# Altium schematic sheet STM32-ROMI_Rev_A_5_IMU_IO.SchDoc: IMU I/O
size A4; Author: Kyle R; Organization: Altium Limited; Address1: L3, 12a Rodborough Rd; Address2: Frenchs Forest; Address3: NSW; Address4: Australia 2086; DocumentNumber: 9152020; Revision: A; SheetNumber: 5; SheetTotal: 7
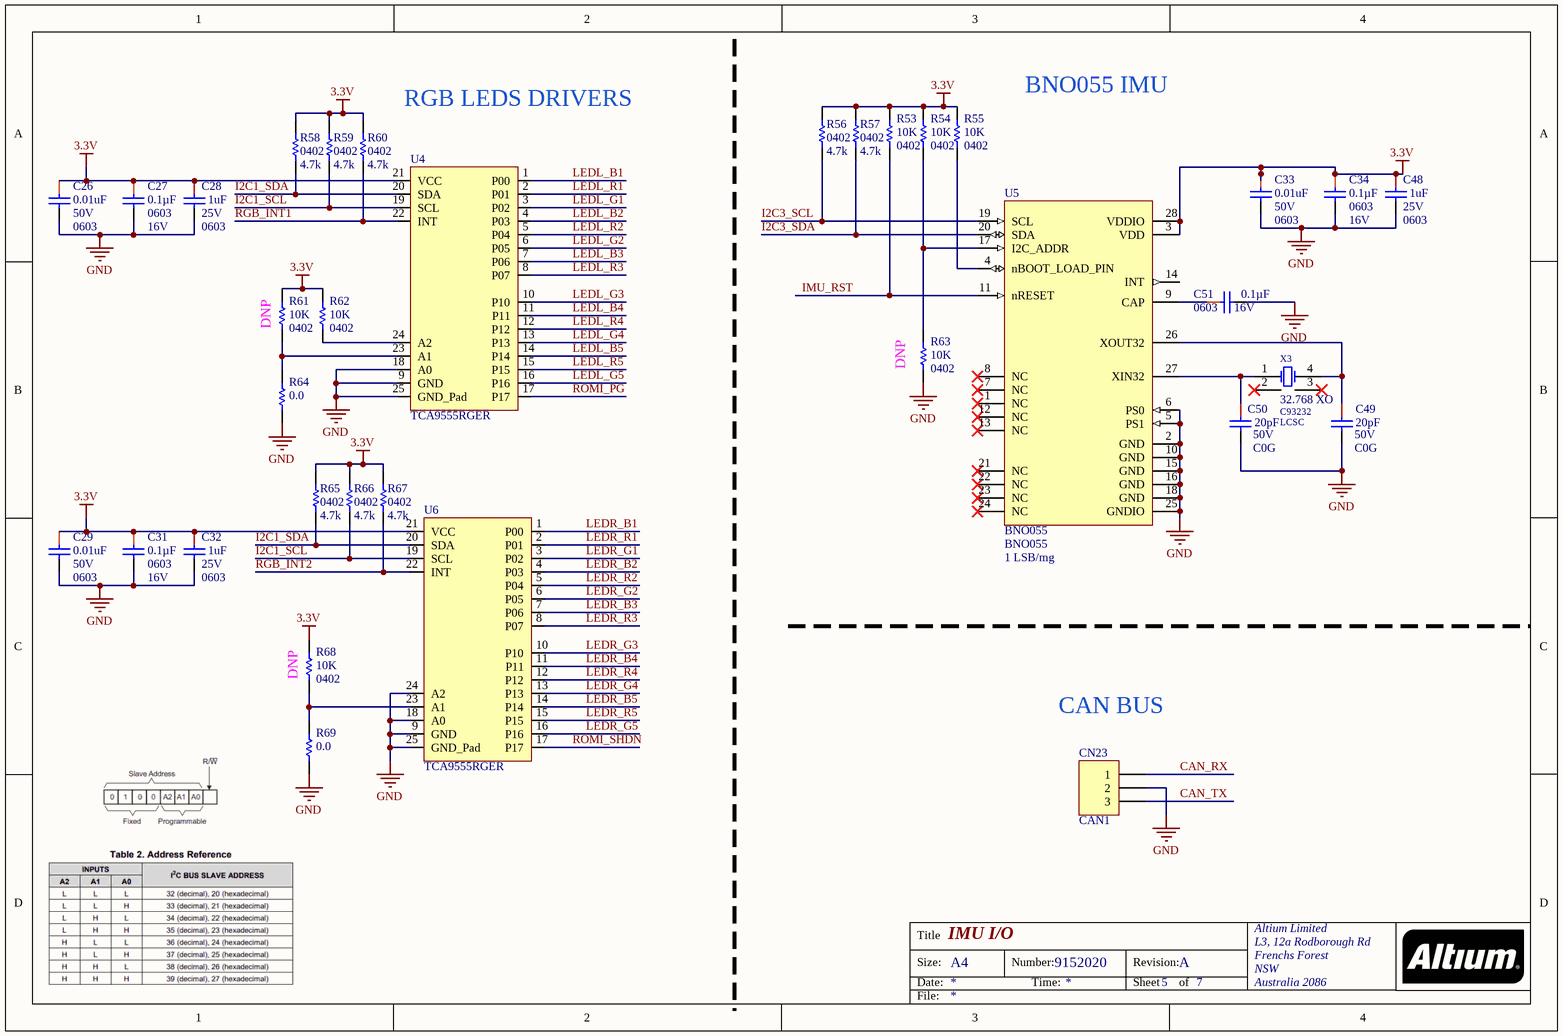
[diagram p0: STM32-ROMI_Rev_A_5_IMU_IO.SchDoc]

## Parts
C26  0.01uF  Voltage - Rated: 50V  Package / Case: 0603  [CAPC0603(1608)_L]
C27  Capacitance: 0.1µF  Package / Case: 0603  Voltage - Rated: 16V  [CAPC0603(1608)_L]  (hidden comment: 0.1uF)
C28  1uF  Voltage - Rated: 25V  Package / Case: 0603  [CAPC0603(1608)_N]
C29  0.01uF  Voltage - Rated: 50V  Package / Case: 0603  [CAPC0603(1608)_L]
C31  Capacitance: 0.1µF  Package / Case: 0603  Voltage - Rated: 16V  [CAPC0603(1608)_L]  (hidden comment: 0.1uF)
C32  1uF  Voltage - Rated: 25V  Package / Case: 0603  [CAPC0603(1608)_N]
C33  0.01uF  Voltage - Rated: 50V  Package / Case: 0603  [CAPC0603(1608)_L]
C34  Capacitance: 0.1µF  Package / Case: 0603  Voltage - Rated: 16V  [CAPC0603(1608)_L]  (hidden comment: 0.1uF)
C48  1uF  Voltage - Rated: 25V  Package / Case: 0603  [CAPC0603(1608)_N]
C49  Voltage - Rated: 50V  Temperature Coefficient: C0G  Capacitance: 20pF  [CAPC0402(1005)_L]  (hidden comment: 20pF 0402)
C50  Voltage - Rated: 50V  Temperature Coefficient: C0G  Capacitance: 20pF  [CAPC0402(1005)_L]  (hidden comment: 20pF 0402)
C51  Capacitance: 0.1µF  Package / Case: 0603  Voltage - Rated: 16V  [CAPC0603(1608)_L]  (hidden comment: 0.1uF)
CN23  CAN1  [HDR1X3]
R53  10K  Supplier Device Package: 0402  [RESC0402(1005)_N]
R54  10K  Supplier Device Package: 0402  [RESC0402(1005)_N]
R55  10K  Supplier Device Package: 0402  [RESC0402(1005)_N]
R56  Package / Case: 0402  [RESC0402(1005)_N]  (hidden comment: 4.7K)
R57  Package / Case: 0402  [RESC0402(1005)_N]  (hidden comment: 4.7K)
R58  Package / Case: 0402  [RESC0402(1005)_N]  (hidden comment: 4.7K)
R59  Package / Case: 0402  [RESC0402(1005)_N]  (hidden comment: 4.7K)
R60  Package / Case: 0402  [RESC0402(1005)_N]  (hidden comment: 4.7K)
R61  10K  Supplier Device Package: 0402  [RESC0402(1005)_N]  (no BOM)
R62  10K  Supplier Device Package: 0402  [RESC0402(1005)_N]
R63  10K  Supplier Device Package: 0402  [RESC0402(1005)_N]  (no BOM)
R64  Resistance (Ohms): 0.0  [RESC0402(1005)_L]  (hidden comment: 0)
R65  Package / Case: 0402  [RESC0402(1005)_N]  (hidden comment: 4.7K)
R66  Package / Case: 0402  [RESC0402(1005)_N]  (hidden comment: 4.7K)
R67  Package / Case: 0402  [RESC0402(1005)_N]  (hidden comment: 4.7K)
R68  10K  Supplier Device Package: 0402  [RESC0402(1005)_N]  (no BOM)
R69  Resistance (Ohms): 0.0  [RESC0402(1005)_L]  (hidden comment: 0)
U4  TCA9555RGER  [QFN50P400X400X100_HS-25N]
U5  BNO055  Sensitivity: 1 LSB/mg  [LGA-28-3.8x5.2mm]
U6  TCA9555RGER  [QFN50P400X400X100_HS-25N]
X3  32.768 XO  Supplier Part Number 2: C93232  Supplier 2: LCSC  [OSCABS]

## Nets
3.3V: C26.1 C27.1 C28.1 C29.1 C31.1 C32.1 C33.1 C34.1 C48.1 R53.2 R54.2 R55.2 R56.2 R57.2 R58.2 R59.2 R60.2 R61.2 R62.2 R65.2 R66.2 R67.2 R68.2 U4.21(VCC) U5.3(VDD) U5.28(VDDIO) U6.21(VCC)
GND: C26.2 C27.2 C28.2 C29.2 C31.2 C32.2 C33.2 C34.2 C48.2 C49.2 C50.2 C51.2 CN23.2 R63.1 R64.1 R69.1 U4.9(GND) U4.18(A0) U4.25(GND_Pad) U5.2(GND) U5.5(PS1) U5.6(PS0) U5.10(GND) U5.15(GND) U5.16(GND) U5.18(GND) U5.25(GNDIO) U6.9(GND) U6.18(A0) U6.24(A2) U6.25(GND_Pad)
CAN_RX: CN23.1
CAN_TX: CN23.3
I2C1_SCL: R59.1 R66.1 U4.19(SCL) U6.19(SCL)
I2C1_SDA: R58.1 R65.1 U4.20(SDA) U6.20(SDA)
I2C3_SCL: R56.1 U5.19(SCL)
I2C3_SDA: R57.1 U5.20(SDA)
IMU_RST: R53.1 U5.11(nRESET)
LEDL_B1: U4.1(P00)
LEDL_B2: U4.4(P03)
LEDL_B3: U4.7(P06)
LEDL_B4: U4.11(P11)
LEDL_B5: U4.14(P14)
LEDL_G1: U4.3(P02)
LEDL_G2: U4.6(P05)
LEDL_G3: U4.10(P10)
LEDL_G4: U4.13(P13)
LEDL_G5: U4.16(P16)
LEDL_R1: U4.2(P01)
LEDL_R2: U4.5(P04)
LEDL_R3: U4.8(P07)
LEDL_R4: U4.12(P12)
LEDL_R5: U4.15(P15)
LEDR_B1: U6.1(P00)
LEDR_B2: U6.4(P03)
LEDR_B3: U6.7(P06)
LEDR_B4: U6.11(P11)
LEDR_B5: U6.14(P14)
LEDR_G1: U6.3(P02)
LEDR_G2: U6.6(P05)
LEDR_G3: U6.10(P10)
LEDR_G4: U6.13(P13)
LEDR_G5: U6.16(P16)
LEDR_R1: U6.2(P01)
LEDR_R2: U6.5(P04)
LEDR_R3: U6.8(P07)
LEDR_R4: U6.12(P12)
LEDR_R5: U6.15(P15)
RGB_INT1: R60.1 U4.22(INT)
RGB_INT2: R67.1 U6.22(INT)
ROMI_PG: U4.17(P17)
ROMI_SHDN: U6.17(P17)
NetC49_1: C49.1 U5.26(XOUT32) X3.4(OSC2)
NetC50_1: C50.1 U5.27(XIN32) X3.1(OSC1)
NetC51_1: C51.1 U5.9(CAP)
NetR54_1: R54.1 R63.2 U5.17(I2C_ADDR)
NetR55_1: R55.1 U5.4(nBOOT_LOAD_PIN)
NetR61_1: R61.1 R64.2 U4.23(A1)
NetR62_1: R62.1 U4.24(A2)
NetR68_1: R68.1 R69.2 U6.23(A1)

Not connected (* = marked no-connect by the designer): U5 1(NC)* 7(NC)* 8(NC)* 12(NC)* 13(NC)* 14(INT) 21(NC)* 22(NC)* 23(NC)* 24(NC)*; X3 2(NC)* 3(NC)*

## Notes on the sheet
- RGB LEDS DRIVERS
- BNO055 IMU
- (near R61) DNP
- (near R63) DNP
- (near R68) DNP
- CAN BUS
- Title
- Size:
- Date:
- A4
- Number:
- Time:
- Revision:
- Sheet
- of
- File:

## Library data of the parts
C26 C29 C33 = CAP CER 0.01uF 50V 10% X7R 0603: 0.01uF 50V 0603; Manufacturer: Kemet; Manufacturer Part Number: C0603C103K5RACTU; Capacitance: 10000pF; Tolerance: ±10%; Temperature Coefficient: X7R; ClassName: MCU; Supplier 1: Digi-Key; RoHS: RoHS Compliant; Category: Capacitors; Stock 1: 1304139; Pricing 1: 1=0.1, 10=0.02, 25=0.014, 50=0.0106, 100=0.009, 250=0.00736, 1000=0.0048 (USD); Packaging: Cut Tape (CT); Mounting Type: Surface Mount, MLCC; Operating Temperature: -55°C ~ 125°C; Applications: General Purpose; Ratings: -; Size / Dimension: 0.063" L x 0.031" W (1.60mm x 0.80mm); Height - Seated (Max): -; Thickness (Max): 0.034" (0.87mm); Lead Spacing: -; Features: -; Lead Style: -; ComponentLink1URL: http://www.kemet.com/docfinder?Partnumber=C0603C103K5RACTU; ComponentLink1Description: http://www.kemet.com/docfinder?Partnumber=C0603C103K5RACTU; Supplier Part Number 1: 399-1091-1-ND
C27 C31 C34 C51 = CAP CER 0.1UF 16V 10% X7R 0603: 0.1uF 0603 16V; Manufacturer: Kemet; Manufacturer Part Number: C0603C104K4RACTU; Tolerance: ±10%; Temperature Coefficient: X7R; Supplier 1: Digi-Key; RoHS: RoHS Compliant; Category: Capacitors; Stock 1: 2360000; Pricing 1: 4000=0.00414, 8000=0.00378, 12000=0.0036, 28000=0.00342, 100000=0.00248 (USD); Packaging: Tape & Reel (TR); Mounting Type: Surface Mount, MLCC; Operating Temperature: -55°C ~ 125°C; Applications: General Purpose; Ratings: -; Size / Dimension: 0.063" L x 0.031" W (1.60mm x 0.80mm); Height - Seated (Max): -; Thickness (Max): 0.034" (0.87mm); Lead Spacing: -; Features: -; Lead Style: -; ComponentLink1URL: http://www.kemet.com/datasheets&C0603C104K4RACTU; ComponentLink1Description: http://www.kemet.com/datasheets&C0603C104K4RACTU; Supplier Part Number 1: 399-1096-2-ND
C28 C32 C48 = CAP CER 1UF 25V 10% X7R 0603: 1uF 0603 25V; Manufacturer: TDK Corporation; Manufacturer Part Number: CGA3E1X7R1E105K080AC; Tolerance: ±10%; Temperature Coefficient: X7R; Supplier 1: Digi-Key; RoHS: RoHS Compliant; Category: Capacitors; Stock 1: 360610; Pricing 1: 1=0.2, 10=0.135, 100=0.0686, 500=0.04696, 1000=0.04154 (USD); Packaging: Cut Tape (CT); Part Status: Active; Operating Temperature: -55°C ~ 125°C; Features: -; Ratings: AEC-Q200; Applications: Automotive; Failure Rate: -; Mounting Type: Surface Mount, MLCC; Size / Dimension: 0.063" L x 0.032" W (1.60mm x 0.80mm); Height - Seated (Max): -; Thickness (Max): 0.035" (0.90mm); Lead Spacing: -; Lead Style: -; ComponentLink1URL: https://product.tdk.com/info/en/catalog/datasheets/mlcc_automotive_general_en.pdf; ComponentLink1Description: https://product.tdk.com/info/en/catalog/datasheets/mlcc_automotive_general_en.pdf; Supplier Part Number 1: 445-6931-1-ND
C49 C50 = CAP CER 20PF 50V 2% NP0 0402: Manufacturer: Murata Electronics North America; Manufacturer Part Number: GRM1555C1H200GA01D; Tolerance: ±2%; ClassName: *; Supplier 1: Digi-Key; RoHS: RoHS Compliant; Category: Capacitors; Stock 1: 80973; Pricing 1: 1=0.11, 10=0.082, 50=0.0444, 100=0.0376, 250=0.03076, 500=0.02632, 1000=0.0201, 5000=0.01675 (USD); Packaging: Cut Tape (CT); Mounting Type: Surface Mount, MLCC; Operating Temperature: -55°C ~ 125°C; Applications: General Purpose; Ratings: -; Size / Dimension: 0.039" L x 0.020" W (1.00mm x 0.50mm); Height - Seated (Max): -; Thickness (Max): 0.022" (0.55mm); Lead Spacing: -; Features: -; Lead Style: -; ComponentLink1URL: http://www.murata.com/~/media/webrenewal/support/library/catalog/products/capacitor/mlcc/c02e.ashx; ComponentLink1Description: http://www.murata.com/~/media/webrenewal/support/library/catalog/products/capacitor/mlcc/c02e.ashx; Supplier Part Number 1: 490-6217-1-ND; Creator: osman
CN23 = Header 3: Header, 3-Pin; Manufacturer: Sullins Connector Solutions; Manufacturer Part Number: PRPC003SAAN-RC; Connector Type: Header, Unshrouded, Breakaway; Number of Positions: 3; Number of Positions Loaded: All; Pitch: 0.100" (2.54mm); Supplier 1: Digi-Key; RoHS: RoHS Compliant; Category: Connectors, Interconnects; Stock 1: 0; Pricing 1: 1=0.18, 10=0.16, 100=0.132, 500=0.10438, 1000=0.0896, 5000=0.08174, 10000=0.0786 (USD); Packaging: Bulk; Contact Type: Male Pin; Number of Rows: 1; Row Spacing: -; Contact Mating Length: 0.230" (5.84mm); Mounting Type: Through Hole; Termination: Solder; Fastening Type: -; Features: -; Contact Finish: Gold; Contact Finish Thickness: Flash; Color: Black; ComponentLink1URL: http://media.digikey.com/PDF/Data%20Sheets/Sullins%20PDFs/xRxCzzzSxxN-RC_ST_11635-B.pdf; ComponentLink1Description: http://media.digikey.com/PDF/Data%20Sheets/Sullins%20PDFs/xRxCzzzSxxN-RC_ST_11635-B.pdf; Supplier Part Number 1: S1011EC-03-ND
R53-R55 R61-R63 R68 = RES 10K OHM 1% 1/16W 0402: 10K 0402; Manufacturer: Samsung Electro-Mechanics; Manufacturer Part Number: RC1005F103CS; Tolerance: ±1%; Power (Watts): 0.063W, 1/16W; Temperature Coefficient: ±100ppm/°C; Supplier 1: Digi-Key; RoHS: RoHS Compliant; Category: Resistors; Stock 1: 25834562; Pricing 1: 1=0.1, 10=0.021, 100=0.0086, 1000=0.00385, 2500=0.00334, 5000=0.00276 (USD); Packaging: Cut Tape (CT); Part Status: Active; Composition: Thick Film; Features: Moisture Resistant; Operating Temperature: -55°C ~ 155°C; Package / Case: 0402 (1005 Metric); Size / Dimension: 0.039" L x 0.020" W (1.00mm x 0.50mm); Height - Seated (Max): 0.016" (0.40mm); Failure Rate: -; ComponentLink1URL: http://www.samsungsem.com/kr/support/product-search/chip-resistor/RC1005F103CS.jsp; ComponentLink1Description: http://www.samsungsem.com/kr/support/product-search/chip-resistor/RC1005F103CS.jsp; Supplier Part Number 1: 1276-3431-1-ND
R56-R60 R65-R67 = RES 4.7K OHM 1% 1/10W 0402: 4.7K 0402; Manufacturer: Yageo; Manufacturer Part Number: RC0402FR-074K7L; Tolerance: ±1%; Power Rating: 62.5mW; Resistance: 4.7KR; Temperature Coefficient: 100ppm/°C; Voltage Rating: 50V; ComponentLink1URL: http://industrial.panasonic.com/www-cgi/jvcr13pz.cgi?E+PZ+3+AOA0002+ERJ2RKF4701X+7+WW; ComponentLink1Description: http://industrial.panasonic.com/www-cgi/jvcr13pz.cgi?E+PZ+3+AOA0002+ERJ2RKF4701X+7+WW; Supplier 1: Digi-Key; Supplier Part Number 1: 311-4.7KLRCT-ND; Stock 1: 3132666; Pricing 1: 1=0.1, 10=0.014, 100=0.0056, 1000=0.0025, 2500=0.0022, 5000=0.0018 (USD); Case/Package: 0402; Number of Pins: 2; Case Code (Imperial): 0402; Case Code (Metric): 1005; Min Operating Temperature: -55°C; Max Operating Temperature: 155°C; Packaging: Tape and Reel; Composition: Thick Film; Termination: SMD/SMT; Military Standard: Not; Length: 1mm; Height: 0.32mm; Depth: 0.5mm; Width: 0.5mm; REACH SVHC: No SVHC; Lead Free: Lead Free; ComponentLink2URL: https://datasheet.ciiva.com/11819/0900766b80c66297-11819507.pdf; ComponentLink2Description: https://datasheet.ciiva.com/11819/0900766b80c66297-11819507.pdf; ComponentLink3URL: https://datasheet.ciiva.com/7850/1018594-7850022.pdf; ComponentLink3Description: https://datasheet.ciiva.com/7850/1018594-7850022.pdf; ComponentLink4URL: https://datasheet.ciiva.com/7850/1018594-7850023.pdf; ComponentLink4Description: https://datasheet.ciiva.com/7850/1018594-7850023.pdf; ComponentLink5URL: https://datasheet.ciiva.com/15215/getdatasheetpartid-328119-15215035.pdf; ComponentLink5Description: https://datasheet.ciiva.com/15215/getdatasheetpartid-328119-15215035.pdf; ComponentLink6URL: https://datasheet.ciiva.com/22661/1686128-22661342.pdf; ComponentLink6Description: https://datasheet.ciiva.com/22661/1686128-22661342.pdf; Category: Resistors; Resistance (Ohms): 4.7k
R64 R69 = RES 0.0 OHM JUMPER 1/10W 0402: 0.0 0402; Manufacturer: Panasonic Electronic Components; Manufacturer Part Number: ERJ-2GE0R00X; Tolerance: Jumper; Power (Watts): 0.1W, 1/10W; Supplier 1: Digi-Key; RoHS: RoHS Compliant; Category: Resistors; Stock 1: 8429476; Pricing 1: 1=0.1, 50=0.0138, 100=0.0105, 250=0.0078, 500=0.00576, 1000=0.00384, 5000=0.0027 (USD); Packaging: Cut Tape (CT); Composition: Thick Film; Features: Automotive AEC-Q200; Temperature Coefficient: -; Operating Temperature: -55°C ~ 155°C; Package / Case: 0402 (1005 Metric); Supplier Device Package: 0402; Size / Dimension: 0.039" L x 0.020" W (1.00mm x 0.50mm); Height: 0.016" (0.40mm); Number of Terminations: 2; ComponentLink1URL: http://industrial.panasonic.com/www-cgi/jvcr13pz.cgi?E+PZ+3+AOA0001+ERJ2GE0R00X+7+WW; ComponentLink1Description: http://industrial.panasonic.com/www-cgi/jvcr13pz.cgi?E+PZ+3+AOA0001+ERJ2GE0R00X+7+WW; Supplier Part Number 1: P0.0JCT-ND; Creator: osman
U4 U6 = CMP-001-0784-04: IC I/O EXPANDER I2C SMBUS 24VQFN; Manufacturer: Texas Instruments; Max Supply Voltage: 5.5V; Interface: I2C, SMBus; Number of I/Os: 16; Min Supply Voltage: 1.65V; Packaging: Cut Tape; Min Operating Temperature: -40°C; Case/Package: VQFN; REACH SVHC: No SVHC; Number of Pins: 24; Lead Free: Lead Free; Max Operating Temperature: 85°C; Manufacturer Part Number: TCA9555RGER
U5 = CMP-010-0024-02: 9-Axis Intertial Sensor; Manufacturer: Bosch Tools; Bandwidth: 1000 Hz; Product Status: New at Mouser; Operating Supply Current: 13.7 mA; Interface: HID-I2C, I2C, UART; Supply Voltage - Max: 3.6 V; Brand: Bosch Sensortec; Acceleration: 2 g, 4 g, 8 g, 16 g; Supply Voltage - Min: 2.4 V; Resolution: 16 bit; RoHS - Mouser: Y; Sensing Axis: 9-axis; RoHS: RoHS Compliant; Pin Count: 28; ComponentLink1URL: http://www.mouser.com/ds/2/621/BST_BNO055_DS000_12~1-531239.pdf; Stock 1: 5828; Package / Case: LGA-28; Maximum Operating Temperature: + 85 C; Packaging: Bulk; Component Name: BNO055; Minimum Order Quantity: 1; Minimum Operating Temperature: - 40 C; Reeling: False; ComponentLink1Description: http://www.mouser.com/ds/2/621/BST_BNO055_DS000_12~1-531239.pdf; Pricing 1: 1=17.58, 5=16.75, 10=16.43, 25=15.20, 50=15.01, 100=14.26, 250=13.30, 500=12.64, 1000=11.63 (AUD); Manufacturer Part Number: BNO055
X3 = DST310S 32.768KHz: SMD CRYSTAL RESONATORS 32.768KHZ ±20PPM SMD-3215_2P ROHS; Supplier 1: Digi-Key; Supplier Part Number 1: 535-10240-1-ND